# Altium schematic sheet PortsSplitter.SchDoc
size B; Organization: Altium Limited; Address1: L3, 12a Rodborough Rd; Address2: Frenchs Forest; Address3: NSW; Address4: Australia 2086; DocumentNumber: 2; SheetNumber: 2; SheetTotal: 2
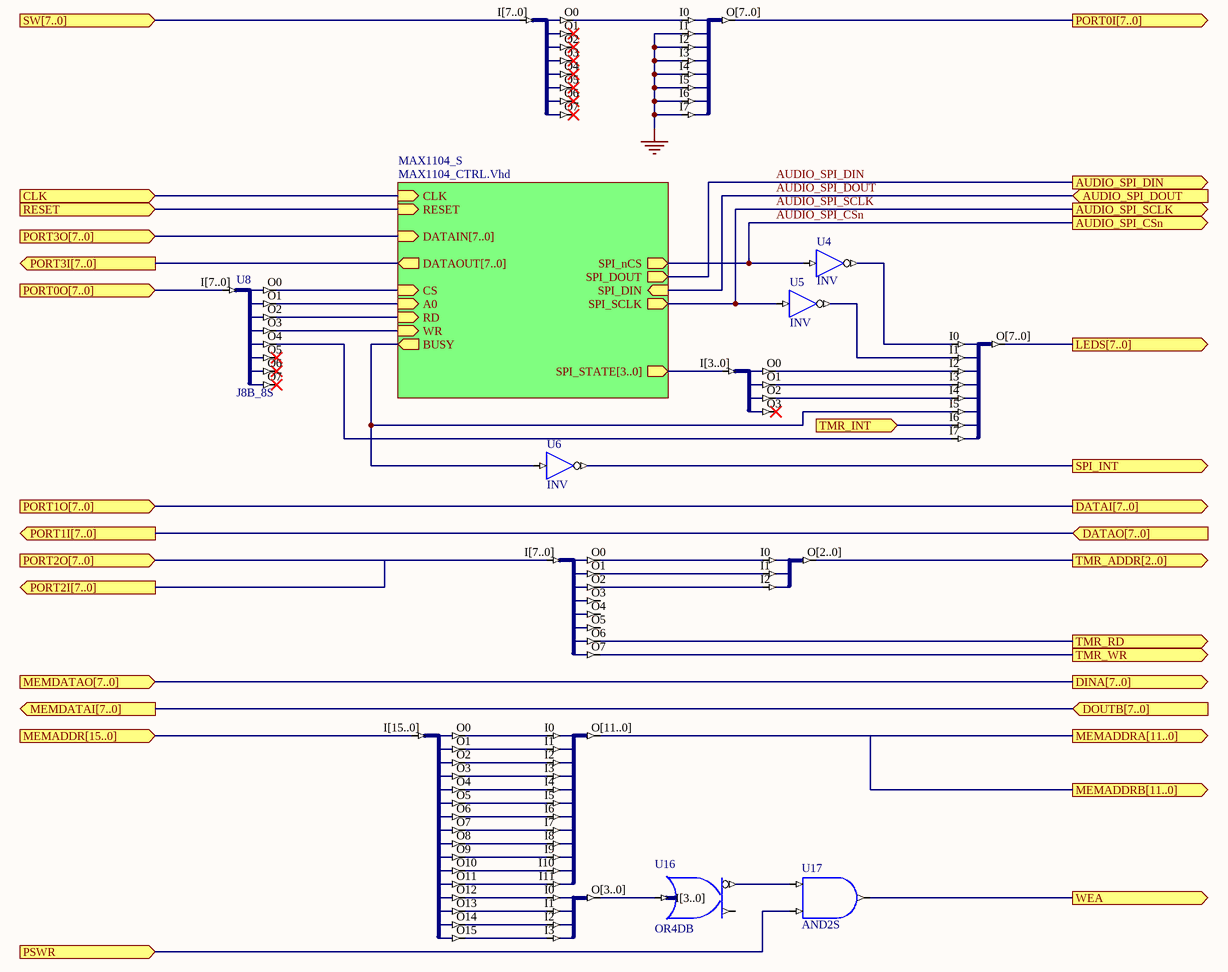
[diagram p0: PortsSplitter.SchDoc]

## Parts
U4  INV
U5  INV
U6  INV
U7  J8B_8S  (value not drawn)
U8  J8B_8S
U9  J8B_8S  (value not drawn)
U10  J8S_8B  (value not drawn)
U11  J8S_8B  (value not drawn)
U12  J4B_4S  (value not drawn)
U13  J3S_3B  (value not drawn)
U14  J16B_16S  (value not drawn)
U15  J12S_12B  (value not drawn)
U16  OR4DB
U17  AND2S
U18  J4S_4B  (value not drawn)

## Sub-sheets
MAX1104_S = MAX1104_CTRL.Vhd: DATAIN[7..0] (in), CS (in), BUSY (out), SPI_DOUT (out), SPI_SCLK (out), SPI_nCS (out), SPI_DIN (in), RD (in), WR (in), CLK (in), DATAOUT[7..0] (out), A0 (in), RESET (in), SPI_STATE[3..0] (out)

## Ports
AUDIO_SPI_CSn (out), AUDIO_SPI_DIN (out), AUDIO_SPI_DOUT (in), AUDIO_SPI_SCLK (out), CLK (in), DATAI[7..0] (out), DATAO[7..0] (in), DINA[7..0] (out), DOUTB[7..0] (in), LEDS[7..0] (out), MEMADDR[15..0] (in), MEMADDRA[11..0] (out), MEMADDRB[11..0] (out), MEMDATAI[7..0] (out), MEMDATAO[7..0] (in), PORT0I[7..0] (out), PORT0O[7..0] (in), PORT1I[7..0] (out), PORT1O[7..0] (in), PORT2I[7..0] (out), PORT2O[7..0] (in), PORT3I[7..0] (out), PORT3O[7..0] (in), PSWR (in), RESET (in), SPI_INT (out), SW[7..0] (in), TMR_ADDR[2..0] (out), TMR_INT (in), TMR_RD (out), TMR_WR (out), WEA (out)

## Nets
GND: U10.I1 U10.I2 U10.I3 U10.I4 U10.I5 U10.I6 U10.I7
AUDIO_SPI_CSn: U4.I ; port AUDIO_SPI_CSn, sheet MAX1104_S/SPI_nCS
AUDIO_SPI_DIN: port AUDIO_SPI_DIN, sheet MAX1104_S/SPI_DOUT
AUDIO_SPI_DOUT: port AUDIO_SPI_DOUT, sheet MAX1104_S/SPI_DIN
AUDIO_SPI_SCLK: U5.I ; port AUDIO_SPI_SCLK, sheet MAX1104_S/SPI_SCLK
CLK: port CLK, sheet MAX1104_S/CLK
LEDS[7..0]: U11.O[7..0] ; port LEDS[7..0]
MEMADDR[15..0]: U14.I[15..0] ; port MEMADDR[15..0]
MEMADDRA[11..0]: U15.O[11..0] ; port MEMADDRA[11..0], port MEMADDRB[11..0]
PORT0I[7..0]: U10.O[7..0] ; port PORT0I[7..0]
PORT0O[7..0]: U8.I[7..0] ; port PORT0O[7..0]
PORT2I[7..0]: U9.I[7..0] ; port PORT2O[7..0], port PORT2I[7..0]
PSWR: U17.I1 ; port PSWR
RESET: port RESET, sheet MAX1104_S/RESET
SPI_INT: U6.O ; port SPI_INT
SW[7..0]: U7.I[7..0] ; port SW[7..0]
TMR_ADDR[2..0]: U13.O[2..0] ; port TMR_ADDR[2..0]
TMR_INT: U11.I6 ; port TMR_INT
TMR_RD: U9.O6 ; port TMR_RD
TMR_WR: U9.O7 ; port TMR_WR
WEA: U17.O ; port WEA
NetU4_O: U4.O U11.I0
NetU5_O: U5.O U11.I1
NetU6_I: U6.I U11.I5 ; sheet MAX1104_S/BUSY
NetU7_O0: U7.O0 U10.I0
NetU8_O0: U8.O0 ; sheet MAX1104_S/CS
NetU8_O1: U8.O1 ; sheet MAX1104_S/A0
NetU8_O2: U8.O2 ; sheet MAX1104_S/RD
NetU8_O3: U8.O3 ; sheet MAX1104_S/WR
NetU8_O4: U8.O4 U11.I7
NetU9_O0: U9.O0 U13.I0
NetU9_O1: U9.O1 U13.I1
NetU9_O2: U9.O2 U13.I2
NetU11_I2: U11.I2 U12.O0
NetU11_I3: U11.I3 U12.O1
NetU11_I4: U11.I4 U12.O2
NetU12_I[3..0]: U12.I[3..0] ; sheet MAX1104_S/SPI_STATE[3..0]
NetU14_O0: U14.O0 U15.I0
NetU14_O1: U14.O1 U15.I1
NetU14_O2: U14.O2 U15.I2
NetU14_O3: U14.O3 U15.I3
NetU14_O4: U14.O4 U15.I4
NetU14_O5: U14.O5 U15.I5
NetU14_O6: U14.O6 U15.I6
NetU14_O7: U14.O7 U15.I7
NetU14_O8: U14.O8 U15.I8
NetU14_O9: U14.O9 U15.I9
NetU14_O10: U14.O10 U15.I10
NetU14_O11: U14.O11 U15.I11
NetU14_O12: U14.O12 U18.I0
NetU14_O13: U14.O13 U18.I1
NetU14_O14: U14.O14 U18.I2
NetU14_O15: U14.O15 U18.I3
NetU16_I[3..0]: U16.I[3..0] U18.O[3..0]
NetU16_YN: U16.YN U17.I0

Not connected (* = marked no-connect by the designer): U7 O1* O2* O3* O4* O5* O6* O7*; U8 O5* O6* O7*; U9 O3 O4 O5; U12 O3*; U16 Y

## Buses and harness runs
bus port DATAI[7..0] = port PORT1O[7..0]
bus port DATAO[7..0] = port PORT1I[7..0]
bus port DINA[7..0] = port MEMDATAO[7..0]
bus port DOUTB[7..0] = port MEMDATAI[7..0]
bus port MEMADDRA[11..0] = port MEMADDRB[11..0]
bus port PORT2I[7..0] = port PORT2O[7..0]
bus port PORT3I[7..0] = sheet MAX1104_S/DATAOUT[7..0]
bus port PORT3O[7..0] = sheet MAX1104_S/DATAIN[7..0]

## Notes on the sheet
- Title
- Size:
- Date:
- B
- Number:
- Time:
- Revision:
- Sheet
- of
- File:

## Library data of the parts
U4 U5 = INV: Inverter; ArchiveName: GENERIC; Published: 7-Nov-2003; Publisher: Altium Limited; Xilinx Equivalent: INV; Core Revision: 1.00.00
U6 = INV: Inverter; ArchiveName: GENERIC; VHDLIB_SIM: GENERIC_LIB; Published: 29-Jan-2004; Publisher: Altium Limited; Xilinx Equivalent: INV; Core Revision: 1.00.00
U7 U8 = J8B_8S: 8-Bit input bus to 8 single pin outputs; ArchiveName: GENERIC; Published: 18-Dec-2003; Publisher: Altium Limited; Core Revision: 1.00.00
U9 = J8B_8S: 8-Bit input bus to 8 single pin outputs; ArchiveName: GENERIC; VHDLIB_SIM: GENERIC_LIB; Published: 29-Jan-2004; Publisher: Altium Limited; Core Revision: 1.00.00
U10 U11 = J8S_8B: 8 Single pin inputs to single 8-Bit output bus; ArchiveName: GENERIC; Published: 18-Dec-2003; Publisher: Altium Limited; Core Revision: 1.00.00
U12 = J4B_4S: 4-Bit input bus to 4 Single pin outputs; ArchiveName: GENERIC; VHDLIB_SIM: GENERIC_LIB; Published: 29-Jan-2004; Publisher: Altium Limited; Core Revision: 1.00.00
U13 = J3S_3B: 3 Single pin inputs to single 3-Bit output bus; ArchiveName: GENERIC; VHDLIB_SIM: GENERIC_LIB; Published: 29-Jan-2004; Publisher: Altium Limited; Core Revision: 1.00.00
U14 = J16B_16S: Single 16-Bit input bus to 16 single pin outputs; ArchiveName: GENERIC; VHDLIB_SIM: GENERIC_LIB; Published: 29-Jan-2004; Publisher: Altium Limited; Core Revision: 1.00.00
U15 = J12S_12B: 12 Single pin inputs to single 12-Bit output bus; ArchiveName: GENERIC; VHDLIB_SIM: GENERIC_LIB; Published: 29-Jan-2004; Publisher: Altium Limited; Core Revision: 1.00.00
U16 = OR4DB: 4-Input OR/NOR Gate, Bus Version; ArchiveName: GENERIC; VHDLIB_SIM: GENERIC_LIB; Published: 29-Jan-2004; Publisher: Altium Limited; Core Revision: 1.00.00
U17 = AND2S: 2-Input AND Gate, Single Pin Version; Xilinx Equivalent: AND2; ArchiveName: GENERIC; VHDLIB_SIM: GENERIC_LIB; Published: 29-Jan-2004; Publisher: Altium Limited; Core Revision: 1.00.00
U18 = J4S_4B: 4 Single pin inputs to single 4-Bit output bus; ArchiveName: GENERIC; VHDLIB_SIM: GENERIC_LIB; Published: 29-Jan-2004; Publisher: Altium Limited; Core Revision: 1.00.00